# Altium schematic sheet 5V-buck.SchDoc
size A; SheetNumber: 7; SheetTotal: 8
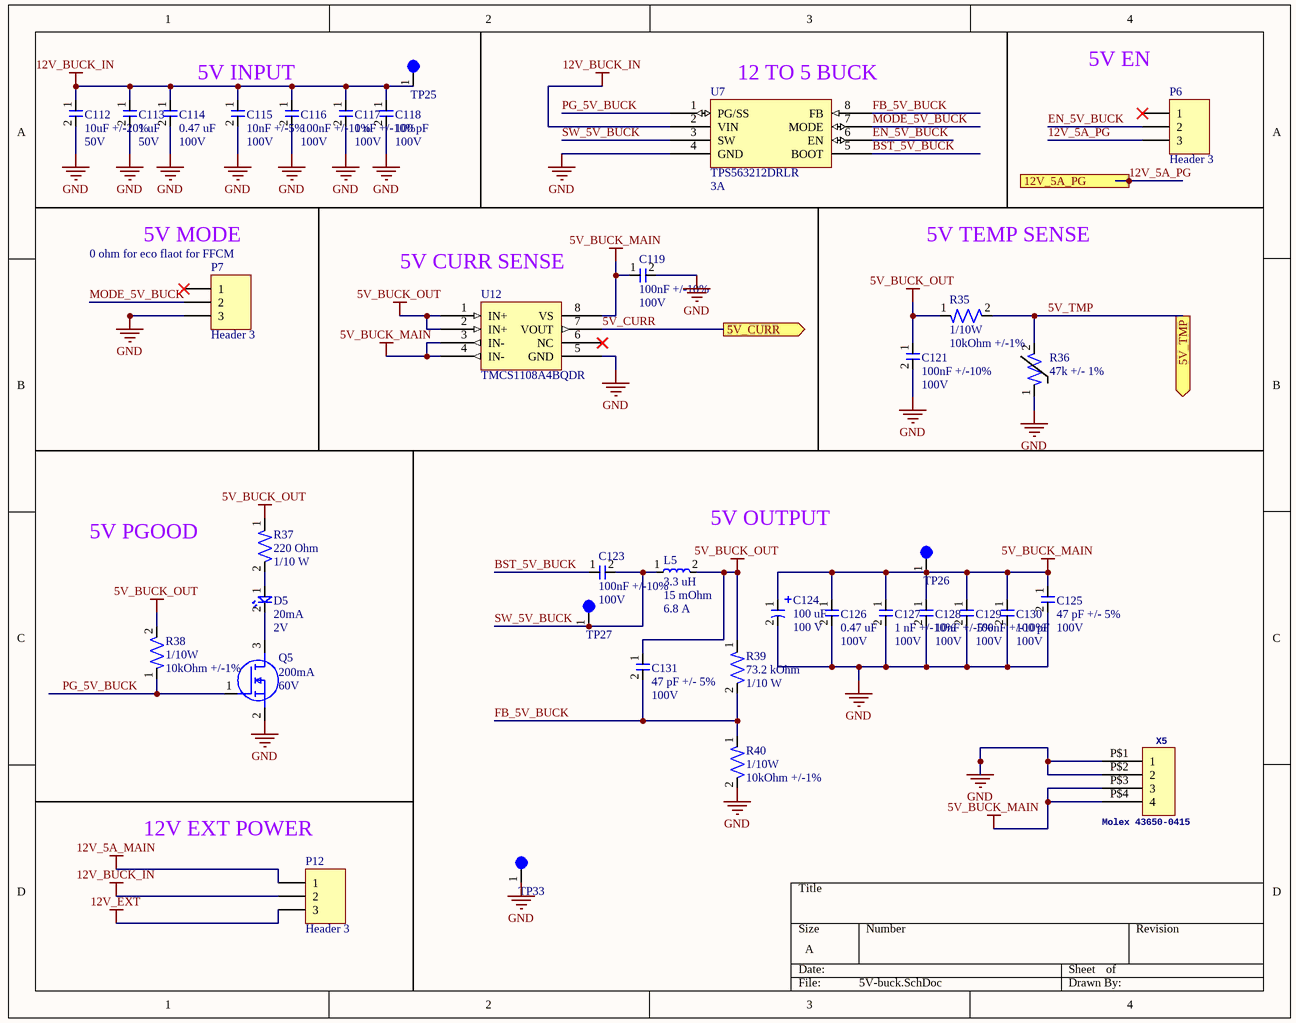
[diagram p0: 5V-buck.SchDoc]

## Parts
C112  Capacitance: 10uF +/-20%  Voltage Rating: 50V  [CAP-1206]  (hidden comment: CL31B106KBHNNNE)
C113  Capacitance: 1 uF  Voltage: 50V  [CAP-0603]  (hidden comment: UMK107AB7105KA-T)
C114  Capacitance: 0.47 uF  Voltage: 100V  [CAP-0805]  (hidden comment: KAM21KR72A474KL)
C115  Capacitance: 10nF +/-5%  Voltage Rating: 100V  [CAP-0603]  (hidden comment: C1608C0G2A103J080AC)
C116  Capacitance: 100nF +/-10%  Voltage Rating: 100V  [CAP-0603]  (hidden comment: CC0603KRX7R0BB104)
C117  Capacitance: 1 nF +/-10%  Voltage: 100V  [CAP-0603]  (hidden comment: C0603Y102K1RAC7867)
C118  Capacitance: 100 pF  Voltage: 100V  [CAP-0603]  (hidden comment: 0603N101J101CT)
C119  Capacitance: 100nF +/-10%  Voltage Rating: 100V  [CAP-0603]  (hidden comment: CC0603KRX7R0BB104)
C121  Capacitance: 100nF +/-10%  Voltage Rating: 100V  [CAP-0603]  (hidden comment: CC0603KRX7R0BB104)
C123  Capacitance: 100nF +/-10%  Voltage Rating: 100V  [CAP-0603]  (hidden comment: CC0603KRX7R0BB104)
C124  Capacitance: 100 uF  Voltage: 100 V  [ELEC-100U-0001]  (hidden comment: 100SEV100M12.5X16)
C125  Capacitance: 47 pF +/- 5%  Voltage Rating: 100V  [CAP-0603]  (hidden comment: 7447798111)
C126  Capacitance: 0.47 uF  Voltage: 100V  [CAP-0805]  (hidden comment: KAM21KR72A474KL)
C127  Capacitance: 1 nF +/-10%  Voltage: 100V  [CAP-0603]  (hidden comment: C0603Y102K1RAC7867)
C128  Capacitance: 10nF +/-5%  Voltage Rating: 100V  [CAP-0603]  (hidden comment: C1608C0G2A103J080AC)
C129  Capacitance: 100nF +/-10%  Voltage Rating: 100V  [CAP-0603]  (hidden comment: CC0603KRX7R0BB104)
C130  Capacitance: 100 pF  Voltage: 100V  [CAP-0603]  (hidden comment: 0603N101J101CT)
C131  Capacitance: 47 pF +/- 5%  Voltage Rating: 100V  [CAP-0603]  (hidden comment: 7447798111)
D5  Current Rating: 20mA  Vf: 2V  [LED-0603]  (hidden comment: 150060AS75000)
L5  Inductance: 3.3 uH  DCR: 15 mOhm  DCI: 6.8 A  [PWRIND-3.3U-0003]  (hidden comment: SRR1240-3R3Y)
P6  Header 3  [HDR1X3]
P7  Header 3  [HDR1X3]
P12  Header 3  [HDR1X3]
Q5  Id-Continuous: 200mA  VDS-Max: 60V  [NMOS-SOT23-3]  (hidden comment: T2N7002AK,LM)
R35  Power Rating: 1/10W  Resistance: 10kOhm +/-1%  [RES-0603]  (hidden comment: RC0603FR-0710KP)
R36  Resistance: 47k +/- 1%  [RES-0402]  (hidden comment: TMP6431DECR)
R37  Resistance: 220 Ohm  Power: 1/10 W  [RES-0603]  (hidden comment: CRGCQ0603J220R)
R38  Power Rating: 1/10W  Resistance: 10kOhm +/-1%  [RES-0603]  (hidden comment: RC0603FR-0710KP)
R39  Resistance: 73.2 kOhm  Power: 1/10 W  [RES-0603]  (hidden comment: RC0603FR-0773K2L)
R40  Power Rating: 1/10W  Resistance: 10kOhm +/-1%  [RES-0603]  (hidden comment: RC0603FR-0710KP)
TP25  5003  [TEST-POINT-0001]  (value not drawn)
TP26  5003  [TEST-POINT-0001]  (value not drawn)
TP27  5003  [TEST-POINT-0001]  (value not drawn)
TP33  5003  [TEST-POINT-0001]  (value not drawn)
U7  TPS563212DRLR  Current: 3A  [IC-SOT583]
U12  TMCS1108A4BQDR  [IC-CURRENT-0001]
X5  Molex 43650-0415  [43650-0415]

## Ports
5V_CURR (out), 5V_TMP (out), 12V_5A_PG (in)

## Nets
5V_BUCK_MAIN: C119.1 C124.1 C125.1 C126.1 C127.1 C128.1 C129.1 C130.1 TP26.1 U12.3(IN-) U12.4(IN-) U12.8(VS) X5.P$3(3) X5.P$4(4)
5V_BUCK_OUT: C121.1 C131.1 L5.2 R35.1 R37.1 R38.2 R39.1 U12.1(IN+) U12.2(IN+)
12V_5A_MAIN: P12.1
12V_BUCK_IN: C112.1 C113.1 C114.1 C115.1 C116.1 C117.1 C118.1 P12.2 TP25.1 U7.2(VIN)
12V_EXT: P12.3
GND: C112.2 C113.2 C114.2 C115.2 C116.2 C117.2 C118.2 C119.2 C121.2 C124.2 C125.2 C126.2 C127.2 C128.2 C129.2 C130.2 P7.3 Q5.2(S) R36.1 R40.2 TP33.1 U7.4(GND) U12.5(GND) X5.P$1(1) X5.P$2(2)
5V_CURR: U12.7(VOUT) ; port 5V_CURR
5V_TMP: R35.2 R36.2 ; port 5V_TMP
12V_5A_PG: P6.3 ; port 12V_5A_PG
BST_5V_BUCK: C123.1 U7.5(BOOT)
EN_5V_BUCK: P6.2 U7.6(EN)
FB_5V_BUCK: C131.2 R39.2 R40.1 U7.8(FB)
MODE_5V_BUCK: P7.2 U7.7(MODE)
PG_5V_BUCK: Q5.1(G) R38.1 U7.1(PG/SS)
SW_5V_BUCK: C123.2 L5.1 TP27.1 U7.3(SW)
NetD5_1: D5.1 R37.2
NetD5_2: D5.2 Q5.3(D)

Not connected (* = marked no-connect by the designer): P6 1*; P7 1*; U12 6(NC)*

## Notes on the sheet
- 5V INPUT
- (near U7) 12 TO 5 BUCK
- (near P6) 5V EN
- (near P7) 0 ohm for eco flaot for FFCM
- (near P7) 5V MODE
- (near U12) 5V CURR SENSE
- 5V TEMP SENSE
- 5V PGOOD
- (near L5) 5V OUTPUT
- (near P12) 12V EXT POWER

## Library data of the parts
C112 = CAP-10U-0001: 10 µF ±10% 50V Ceramic Capacitor X7R 1206 (3216 Metric); Manufacturer: Samsung Electro-Mechanics; Assembled?: no; Manufacturer Part Number: CL31B106KBHNNNE; Temperature Coefficient: X7R; Package Size: 1206
C113 = CAP-1U-0002: 1 µF ±10% 50V Ceramic Capacitor X7R 0603 (1608 Metric); Package Size: 0603
C114 C126 = CAP-0.47U-0001: 0.47 µF ±10% 100V Ceramic Capacitor X7R 0805 (2012 Metric); Tolerance: +/- 10%; Assembled?: No; Temperature Coefficient: X7R; Package Size: 0805
C115 C128 = CAP-10N-0002: CAP CER 10000PF 100V C0G 0603; Manufacturer: TDK Corporation; Temperature Coefficient: C0G/NP0; Assembled?: no; Manufacturer Part Number: C1608C0G2A103J080AC; Package Size: 0603
C116 C119 C121 C123 C129 = CAP-100N-0001: CAP CER 0.1UF 100V X7R 0603; Manufacturer: YAGEO; Assembled?: no; Manufacturer Part Number: CC0603KRX7R0BB104; Temperature Coefficient: X7R; Package Size: 0603
C117 C127 = CAP-1N-0001: 1000 pF ±10% 100V Ceramic Capacitor X7R 0603 (1608 Metric)
C118 C130 = CAP-100P-0002: 100 pF ±5% 100V Ceramic Capacitor C0G, NP0 0603 (1608 Metric); Tolerance: +/-5%; Temp Coeff: C0G/NP0; Package Size: 0603
C124 = ELEC-100U-0001: 100 µF 100 V Aluminum Electrolytic Capacitors Radial, Can - SMD 2000 Hrs @ 85°C; Manufacturer: Rubycon; Tolerance: +/- 20%; Assembled?: No; ESR: idk check the datasheet i couldnt find it
C125 C131 = CAP-47P-0001: 47 pF ±5% 100V Ceramic Capacitor C0G, NP0 0603 (1608 Metric)
D5 = LED_Amber_0001: CAP CER 0.1UF 100V X7R 0603; Manufacturer: Wurth Electronik; Assembled?: no; Color: Amber; Manufacturer Part Number: 150060AS75000; Package Size: 0603
L5 = PWRIND-3.3U-0003: 3.3 µH Shielded Drum Core, Wirewound Inductor 6.8 A 15mOhm Max Nonstandard; Isat: 6.5A; Tolerance: 30%; Assembled?: No
P6 P7 P12 = Header 3: Header, 3-Pin; LatestRevisionDate: 17-Jul-2002; LatestRevisionNote: Re-released for DXP Platform.; Publisher: Altium Limited
Q5 = NMOS-200MA-0001: MOSFET N-CH 60V 200MA SOT23; Manufacturer: Toshiba; FET type: N-Channel; Rds On-Max: 3.9Ohm; Vgs-Max: 20V; Assembled?: no; Manufacturer Part Number: T2N7002AK,LM; Package: SOT-23-3
R35 R38 R40 = RES-10K-0002: RES SMD 10K OHM 1% 1/10W 0603; Manufacturer: YAGEO; Assembled?: no; Manufacturer Part Number: RC0603FR-0710KP; Package Size: 0603
R36 = THERM-47K-0001: PTC Thermistor 47 kOhms 0402 (1006 Metric); Manufacturer: Texas Instruments; Manufacturer Part Number: TMP6431DECR; Package Size: 0402
R37 = RES-220-003: 220 Ohms ±5% 0.1W, 1/10W Chip Resistor 0603 (1608 Metric) Automotive AEC-Q200, Moisture Resistant Thick Film; Tolerance: +/- 5%; Package Size: 0603
R39 = RES-73.2K-0001: 73.2 kOhms ±1% 0.1W, 1/10W Chip Resistor 0603 (1608 Metric) Moisture Resistant Thick Film; Assembled?: No; Tolerance: 1%; Package Size: 0603
TP25-TP27 TP33 = TEST-POINT-0001: Oranange PC Test Point, Miniature Phoisphor Bronze Silver Plating Through Hole Mounting Type
U7 = IC-BUCK-0008: Buck Switching Regulator IC Positive Adjustable 0.6V 1 Output 3A SOT-583; Manufacturer: Texaas Instruments; Assembled?: no; Manufacturer Part Number: TPS563212DRLR; Type: Buck; Package Size: SOT-583
U12 = IC-CURRENT-0004: Current Sensor 1 Channel Hall Effect Bidirectional 8-SOIC (0.154", 3.90mm Width); Assembled?: No; Supply Voltage: 5V; Footprint: 8-SOIC
X5 = Micro-Fit Molex 4 Pin Vertical: GateName_1: G$1; SymbolName_1: HEADER_POS4; DeviceSetName: HEADER_POS4_?; DeviceName: 43650-0415; LibraryName: con-molex-micro-fit-3_0_2; Package: 43650-0415